# Altium schematic sheet BLUENRG-M2SA.SchDoc
size A; SheetNumber: 1; SheetTotal: 3
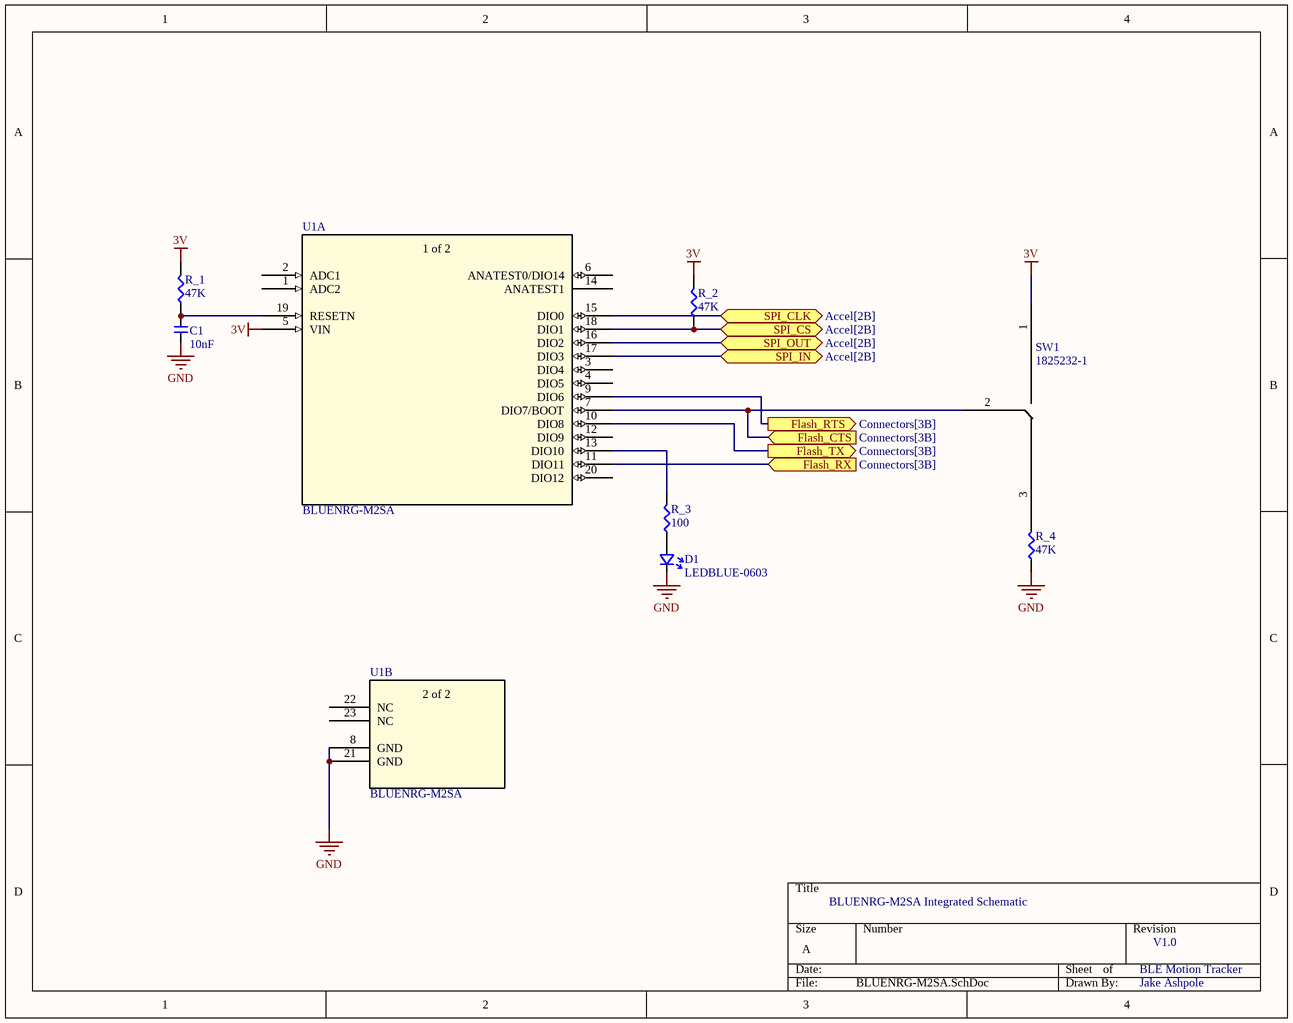
[diagram p0: BLUENRG-M2SA.SchDoc]

## Parts
C1  10nF  [CAP-0603]
D1  LEDBLUE-0603  [LEDBLUE-0603]
R_1  47K  [RES-0603]
R_2  47K  [RES-0603]
R_3  100  [RES-0603]
R_4  47K  [RES-0603]
SW1  1825232-1  [1825232-1_TEC]
U1  BLUENRG-M2SA  [BLUENRG-2M_STM]  (parts A,B of 3)

## Ports
Flash_CTS (in, see Connectors[3B]), Flash_RTS (out, see Connectors[3B]), Flash_RX (in, see Connectors[3B]), Flash_TX (out, see Connectors[3B]), SPI_CLK (bidir, see Accel[2B]), SPI_CS (bidir, see Accel[2B]), SPI_IN (bidir, see Accel[2B]), SPI_OUT (bidir, see Accel[2B])

## Nets
3V: R_1.2 R_2.2 SW1.1 U1.5(VIN)
GND: C1.1 D1.K R_4.1 U1.8(GND) U1.21(GND)
Flash_CTS: SW1.2 U1.7(DIO7/BOOT) ; port Flash_CTS
Flash_RTS: U1.9(DIO6) ; port Flash_RTS
Flash_RX: U1.11(DIO11) ; port Flash_RX
Flash_TX: U1.10(DIO8) ; port Flash_TX
SPI_CLK: U1.15(DIO0) ; port SPI_CLK
SPI_CS: R_2.1 U1.18(DIO1) ; port SPI_CS
SPI_IN: U1.17(DIO3) ; port SPI_IN
SPI_OUT: U1.16(DIO2) ; port SPI_OUT
NetC1_2: C1.2 R_1.1 U1.19(RESETN)
NetD1_A: D1.A R_3.1
NetR_3_2: R_3.2 U1.13(DIO10)
NetR_4_2: R_4.2 SW1.3

Not connected (* = marked no-connect by the designer): U1 1(ADC2) 2(ADC1) 3(DIO4) 4(DIO5) 6(ANATEST0/DIO14) 12(DIO9) 14(ANATEST1) 20(DIO12) 22(NC) 23(NC)

## Notes on the sheet
- BLUENRG-M2SA Integrated Schematic
- BLE Motion Tracker
- V1.0
- Jake Ashpole
- (in symbol BLUENRG-M2SA, part A) 1 of 2
- (in symbol BLUENRG-M2SA, part B) 2 of 2

## Library data of the parts
C1 = CMP-009-000303-1: Source: ife19_Elec_Library.SchLib; Design Item ID: CAP-0603
D1 = CMP-009-000191-1: Design Item ID: LEDBLUE-0603; Source: ife19_Elec_Library.SchLib
R_1-R_4 = CMP-014-000032-1: Source: ife19_Elec_Library.SchLib; Design Item ID: RES-0603
SW1 = 1825232-1: https://www.mouser.com/ProductDetail/655-1825232-1; Mfr_Name: TE Connectivity; RefDes: RefDes; Type: Type
U1 = BLUENRG-M2SA: https://www.mouser.com/ProductDetail/STMicroelectronics/BLUENRG-M2SA?qs=%252B6g0mu59x7K3hjyySj690A%3D%3D; Mfr_Name: STMicroelectronics; RefDes: RefDes; Type: Type